# EAGLE design VCO-revb (EAGLE 9.6.2)
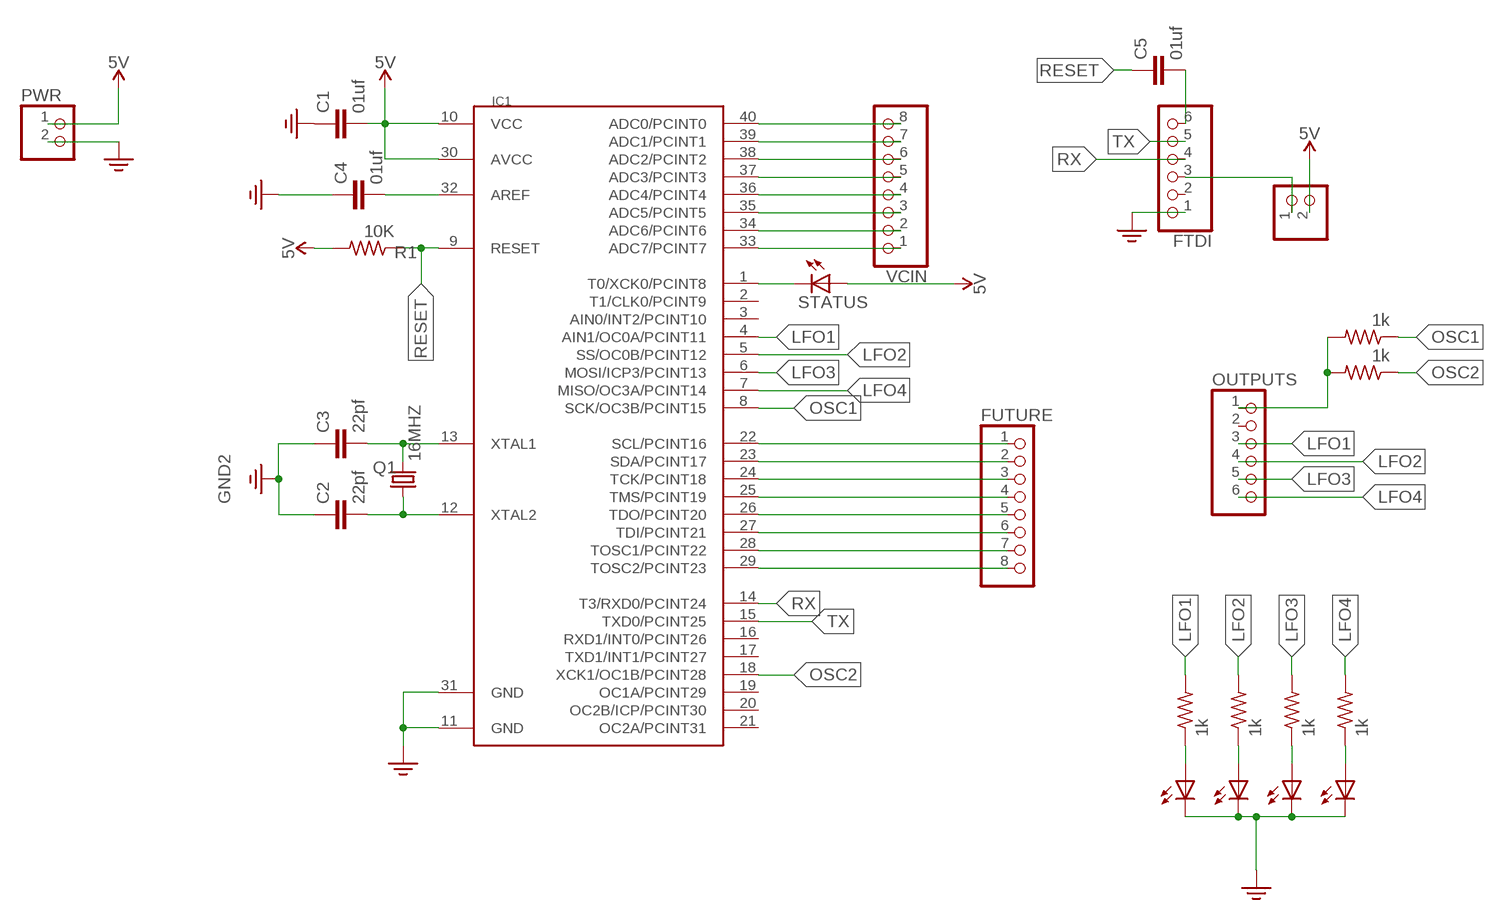
[diagram p0: schematic, sheet 1]

## Parts
C1  01uf  C-EU025-024X044  [C025-024X044]
C2  22pf  C-EU025-024X044  [C025-024X044]
C3  22pf  C-EU025-024X044  [C025-024X044]
C4  01uf  C-EU025-024X044  [C025-024X044]
C5  01uf  C-EU025-024X044  [C025-024X044]
FTDI  PINHD-1X6  [1X06]
FUTURE  PINHD-1X8BIG  [1X08-BIG]
IC1  MEGA1284P  [DIL40]
LFO1  LED5MM  [LED5MM]
LFO2  LED5MM  [LED5MM]
LFO3  LED5MM  [LED5MM]
LFO4  LED5MM  [LED5MM]
OUTPUTS  PINHD-1X6  [1X06]
PWR  PINHD-1X2  [1X02]
PWR1  PINHD-1X2  [1X02]
Q1  16MHZ  CRYSTALHC49S  [HC49/S]
R1  10K  R-US_0207/12  [0207/12]
R2  1k  R-US_0207/12  [0207/12]
R3  1k  R-US_0207/12  [0207/12]
R4  1k  R-US_0207/12  [0207/12]
R5  1k  R-US_0207/12  [0207/12]
R6  1k  R-US_0207/12  [0207/12]
R7  1k  R-US_0207/12  [0207/12]
STATUS  LED5MM  [LED5MM]
VCIN  PINHD-1X8  [1X08]

## Nets
3.3V: C1.1 C2.1 C3.1 C4.1 FTDI.1 IC1.11(GND) IC1.31(GND) LFO1.K(C) LFO2.K(C) LFO3.K(C) LFO4.K(C) PWR.2 ; supply symbol labelled GND2
LFO1: IC1.4(AIN1/OC0A/PCINT11) OUTPUTS.3 R4.2
LFO2: IC1.5(SS/OC0B/PCINT12) OUTPUTS.4 R3.2
LFO3: IC1.6(MOSI/ICP3/PCINT13) OUTPUTS.5 R2.2
LFO4: IC1.7(MISO/OC3A/PCINT14) OUTPUTS.6 R5.2
N$1: LFO1.A R4.1
N$2: IC1.40(ADC0/PCINT0) VCIN.8
N$3: IC1.39(ADC1/PCINT1) VCIN.7
N$4: IC1.38(ADC2/PCINT2) VCIN.6
N$5: IC1.37(ADC3/PCINT3) VCIN.5
N$6: IC1.36(ADC4/PCINT4) VCIN.4
N$7: IC1.35(ADC5/PCINT5) VCIN.3
N$8: IC1.34(ADC6/PCINT6) VCIN.2
N$9: IC1.33(ADC7/PCINT7) VCIN.1
N$10: C3.2 IC1.13(XTAL1) Q1.2
N$11: C2.2 IC1.12(XTAL2) Q1.1
N$12: LFO2.A R3.1
N$13: C4.2 IC1.32(AREF)
N$14: C5.2 FTDI.6
N$15: LFO3.A R2.1
N$16: LFO4.A R5.1
N$17: OUTPUTS.1 R6.2 R7.2
N$18: FUTURE.1 IC1.22(SCL/PCINT16)
N$19: FUTURE.2 IC1.23(SDA/PCINT17)
N$20: FUTURE.3 IC1.24(TCK/PCINT18)
N$21: FUTURE.4 IC1.25(TMS/PCINT19)
N$22: FUTURE.5 IC1.26(TDO/PCINT20)
N$23: FTDI.3 PWR1.1
N$24: IC1.1(T0/XCK0/PCINT8) STATUS.K(C)
N$25: FUTURE.6 IC1.27(TDI/PCINT21)
N$26: FUTURE.7 IC1.28(TOSC1/PCINT22)
N$27: FUTURE.8 IC1.29(TOSC2/PCINT23)
OSC1: IC1.8(SCK/OC3B/PCINT15) R6.1
OSC2: IC1.18(XCK1/OC1B/PCINT28) R7.1
RESET: C5.1 IC1.9(RESET) R1.1
RX: FTDI.4 IC1.14(T3/RXD0/PCINT24)
TX: FTDI.5 IC1.15(TXD0/PCINT25)
VDD: C1.2 IC1.10(VCC) IC1.30(AVCC) PWR1.2 PWR.1 R1.2 STATUS.A ; supply symbol labelled 5V
Unconnected: FTDI.2 IC1.2(T1/CLK0/PCINT9) IC1.3(AIN0/INT2/PCINT10) IC1.16(RXD1/INT0/PCINT26) IC1.17(TXD1/INT1/PCINT27) IC1.19(OC1A/PCINT29) IC1.20(OC2B/ICP/PCINT30) IC1.21(OC2A/PCINT31) OUTPUTS.2

## Library data of the parts
C1-C5 = rcl:C-EU: CAPACITOR, European symbol; SPICEPREFIX: C
FTDI = pinhead:PINHD-1X6: PIN HEADER
FUTURE = adafruit:PINHD-1X8: PIN HEADER
IC1 = 1284p:MEGA1284P: Atmel ATmega1284P 8-bit AVR Microcontroller
LFO1-LFO4 STATUS = adafruit:LED: LED OSRAM: - CHIPLED LG R971, LG N971, LY N971, LG Q971, LY Q971, LO R971, LY R971 LH N974, LH R974 LS Q976, LO Q976, LY Q976 LO Q996 - Hyper CHIPLED LW Q18S LB Q993, LB Q99A, LB R99A - SideLED LS A670, LO A670, LY A670, LG A670, LP A670 LB A673, LV A673, LT A673, LW A673 LH A674 LY A675 LS A676, LA A676, LO A676, LY A676, LW A676 LS A679, LY A679, LG A679 - Hyper Micro SIDELED® LS Y876, LA Y876, LO Y876, LY Y876 LT Y87S - SmartLED LW L88C, LW L88S LB L89C, LB L89S, LG L890 LS L89K, LO L89K, LY L89K LS L896, LA L896, LO L896, LY L896 - TOPLED LS T670, LO T670, LY T670, LG T670, LP T670 LSG T670, LSP T670, LSY T670, LOP T670, LYG T670 LG T671, LOG T671, LSG T671 LB T673, LV T673, LT T673, LW T673 LH T674 LS T676, LA T676, LO T676, LY T676, LB T676, LH T676, LSB T676, LW T676 LB T67C, LV T67C, LT T67C, LS T67K, LO T67K, LY T67K, LW E67C LS E67B, LA E67B, LO E67B, LY E67B, LB E67C, LV E67C, LT E67C LW T67C LS T679, LY T679, LG T679 LS T770, LO T770, LY T770, LG T770, LP T770 LB T773, LV T773, LT T773, LW T773 LH T774 LS E675, LA E675, LY E675, LS T675 LS T776, LA T776, LO T776, LY T776, LB T776 LHGB T686 LT T68C, LB T68C - Hyper Mini TOPLED® LB M676 - Mini TOPLED Santana® LG M470 LS M47K, LO M47K, LY M47K Source: http://www.osram.convergy.de/
OUTPUTS = adafruit:PINHD-1X6: PIN HEADER
PWR PWR1 = pinhead:PINHD-1X2: PIN HEADER
Q1 = adafruit:CRYSTAL: CRYSTAL; OC_FARNELL: 1667008; OC_NEWARK: unknown
R1-R7 = adafruit:R-US_: RESISTOR, American symbol
VCIN = pinhead:PINHD-1X8: PIN HEADER

## Net classes
0 default: clearance 0.205 mm

## Board
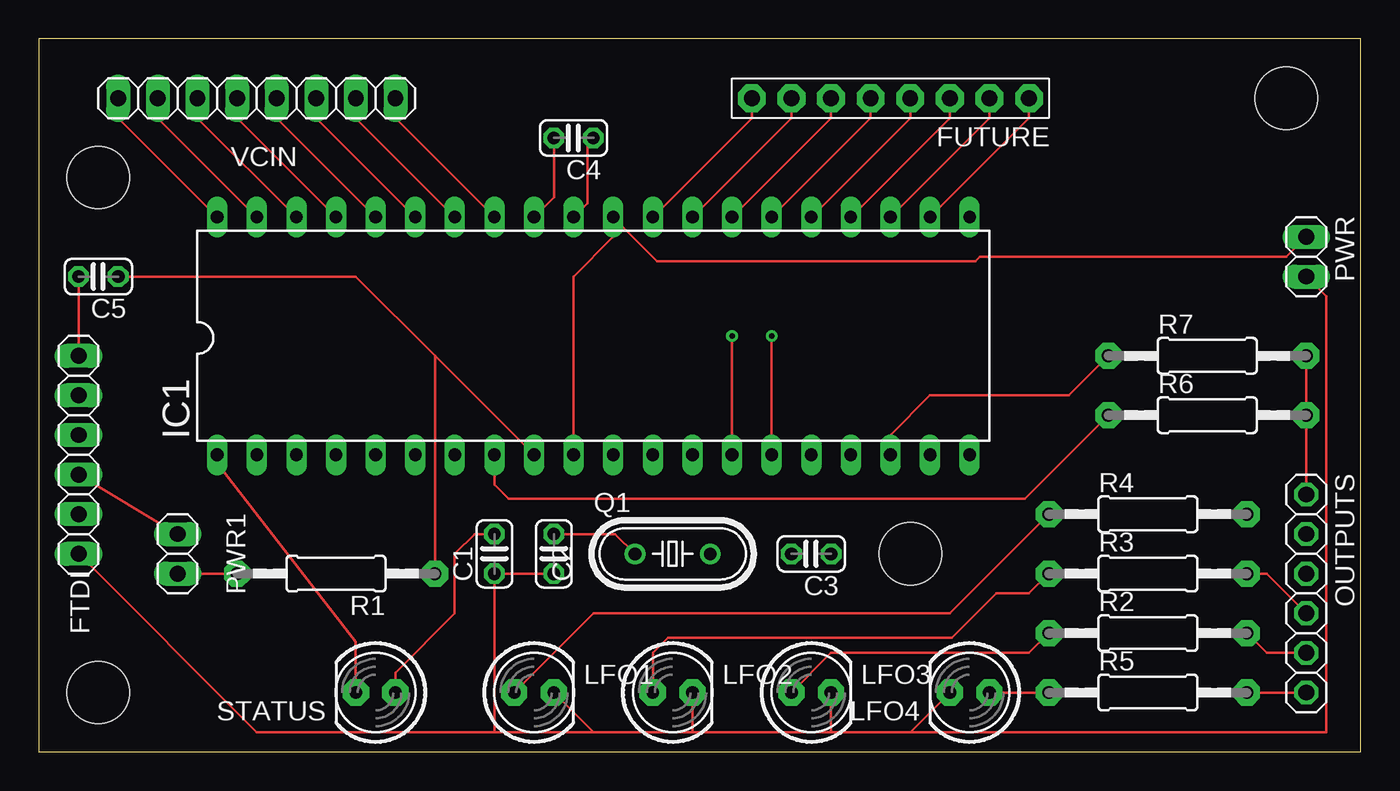
[diagram p1: board, top side]
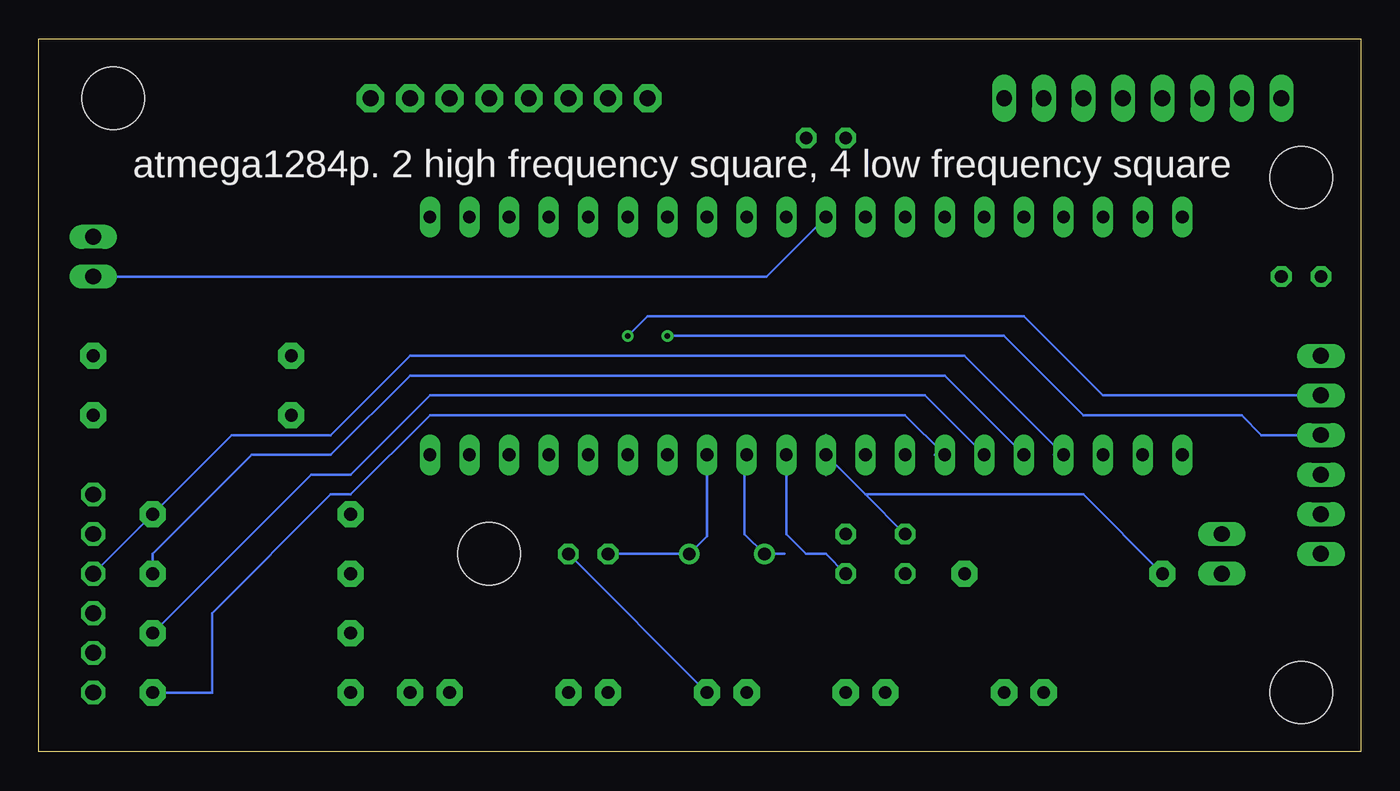
[diagram p2: board, bottom side, seen from below]

Size 84.76 x 45.71 mm. Coordinates in mm from the lower left corner, seen from the top.
Outline: 0,0 84.76,0 84.76,45.71 0,45.71 0,0
Copper layers (1*16): Top 0.035mm / dielectric 1.5mm / Bottom 0.035mm
Design rules "default": minimum track width 6mil, minimum drill 0.35mm, track to track 6mil, track to pad 6mil, pad to pad 6mil, via to via 6mil, smd to smd 6mil, copper to edge 40mil, drill to drill 6mil, minimum pad ring 10mil, minimum via ring 8mil, stop-mask expansion 4mil, vias tented up to drill 0mil, thermal gap 10mil
Holes 4 mm at 80.01,41.91 3.81,3.81 3.81,36.83 55.88,12.7

### Footprints (pad centres in the part's own frame; a part is rotated, then mirrored left to right if it is on the bottom)
C025-024X044 = drill 0.813 octagon: 1 -1.27,0; 2 1.27,0
1X06 = drill 1.016 long: 1 -6.35,0; 2 -3.81,0; 3 -1.27,0; 4 1.27,0; 5 3.81,0; 6 6.35,0
1X08-BIG = drill 1.016 pad 1.778 octagon: 1 -8.89,0; 2 -6.35,0; 3 -3.81,0; 4 -1.27,0; 5 1.27,0; 6 3.81,0; 7 6.35,0; 8 8.89,0
DIL40 = drill 0.813 long: 1 -24.13,-7.62; 2 -21.59,-7.62; 3 -19.05,-7.62; 4 -16.51,-7.62; 5 -13.97,-7.62; 6 -11.43,-7.62; 7 -8.89,-7.62; 8 -6.35,-7.62; 9 -3.81,-7.62; 10 -1.27,-7.62; 11 1.27,-7.62; 12 3.81,-7.62; 13 6.35,-7.62; 14 8.89,-7.62; 15 11.43,-7.62; 16 13.97,-7.62; 17 16.51,-7.62; 18 19.05,-7.62; 19 21.59,-7.62; 20 24.13,-7.62; 21 24.13,7.62; 22 21.59,7.62; 23 19.05,7.62; 24 16.51,7.62; 25 13.97,7.62; 26 11.43,7.62; 27 8.89,7.62; 28 6.35,7.62; 29 3.81,7.62; 30 1.27,7.62; 31 -1.27,7.62; 32 -3.81,7.62; 33 -6.35,7.62; 34 -8.89,7.62; 35 -11.43,7.62; 36 -13.97,7.62; 37 -16.51,7.62; 38 -19.05,7.62; 39 -21.59,7.62; 40 -24.13,7.62
LED5MM = drill 0.813 pad 1.676 octagon: A -1.27,0; K 1.27,0
1X06' = drill 1.016 octagon: 1 -6.35,0; 2 -3.81,0; 3 -1.27,0; 4 1.27,0; 5 3.81,0; 6 6.35,0
1X02 = drill 1.016 long: 1 -1.27,0; 2 1.27,0
HC49/S = drill 0.813: 1 -2.413,0; 2 2.413,0
0207/12 = drill 0.813 pad 1.676 octagon: 1 -6.35,0; 2 6.35,0
1X08 = drill 1.016 long: 1 -8.89,0; 2 -6.35,0; 3 -3.81,0; 4 -1.27,0; 5 1.27,0; 6 3.81,0; 7 6.35,0; 8 8.89,0

### Placement (x,y rotation side)
C1  29.21,12.7 90 top
C2  33.02,12.7 90 top
C3  49.53,12.7 180 top
C4  34.29,39.37 180 top
C5  3.81,30.48 180 top
FTDI  2.54,19.05 90 top
FUTURE  54.61,41.91 180 top
IC1  35.56,26.67 0 top
LFO1  31.75,3.81 0 top
LFO2  40.64,3.81 0 top
LFO3  49.53,3.81 0 top
LFO4  59.69,3.81 180 top
OUTPUTS  [1X06']  81.28,10.16 270 top
PWR  81.28,31.75 270 top
PWR1  8.89,12.7 270 top
Q1  40.64,12.7 0 top
R1  19.05,11.43 180 top
R2  71.12,7.62 0 top
R3  71.12,11.43 0 top
R4  71.12,15.24 0 top
R5  71.12,3.81 0 top
R6  74.93,21.59 0 top
R7  74.93,25.4 0 top
STATUS  21.59,3.81 180 top
VCIN  13.97,41.91 180 top

### Tracks (layer width: path | path; a pad name or v marks a point on that pad's centre or on a via)
3.3V
  Top 0.152: C4.1 35.18,38.99 35.18,35.18 IC1.31 | LFO1.K 35.56,1.27 | 41.91,1.27 35.56,1.27 | 41.91,1.27 50.8,1.27 | 50.8,1.27 55.88,1.27 | LFO3.K 50.8,1.27 | LFO2.K 41.91,1.27 | 55.88,1.27 LFO4.K | FTDI.1 13.97,1.27 22.86,1.27 29.21,1.27 | 35.56,1.27 29.21,1.27 | PWR.2 82.55,29.21 82.55,1.27 55.88,1.27 | C2.1 C1.1 29.21,1.27
  Bottom 0.152: C3.1 LFO2.K | 36.83,17.14 IC1.11 36.83,13.97 35.56,12.7 34.29,12.7 C2.1 | PWR.2 38.1,30.48 IC1.31
LFO1
  Bottom 0.152: 19.67,19.05 IC1.4 25.4,25.4 60.96,25.4 66.04,20.32 72.39,20.32 R4.2 OUTPUTS.3
LFO2
  Top 0.152: R3.2 78.74,11.43 OUTPUTS.4
  Bottom 0.152: IC1.5 26.67,24.13 60.96,24.13 66.04,19.05 71.12,19.05 77.47,12.7 R3.2
LFO3
  Top 0.152: R2.2 78.74,6.35 OUTPUTS.5
  Bottom 0.152: R2.2 67.31,17.78 64.77,17.78 59.69,22.86 27.94,22.86 IC1.6
LFO4
  Top 0.152: R5.2 OUTPUTS.6
  Bottom 0.152: 27.29,19.05 IC1.7 29.21,21.59 59.69,21.59 64.77,16.51 66.04,16.51 73.66,8.89 73.66,3.81 R5.2
N$1
  Top 0.152: R4.1 58.42,8.89 35.56,8.89 LFO1.A
N$2
  Top 0.152: VCIN.8 5.08,40.64 IC1.40
N$3
  Top 0.152: VCIN.7 7.62,40.64 IC1.39
N$4
  Top 0.152: VCIN.6 10.16,40.64 IC1.38
N$5
  Top 0.152: VCIN.5 12.7,40.64 IC1.37
N$6
  Top 0.152: VCIN.4 15.24,40.64 IC1.36
N$7
  Top 0.152: VCIN.3 17.78,40.64 IC1.35
N$8
  Top 0.152: VCIN.2 20.32,40.64 IC1.34
N$9
  Top 0.152: VCIN.1 22.86,40.64 IC1.33
N$10
  Bottom 0.152: IC1.13 41.91,13.84 Q1.2 C3.2
N$11
  Top 0.152: C2.2 36.96,13.97 Q1.1
  Bottom 0.152: IC1.12 39.5,18.92 39.5,13.97 Q1.1 36.96,12.7
N$12
  Top 0.152: LFO2.A 39.37,6.35 40.34,7.32 58.55,7.32 61.39,10.16 63.5,10.16 R3.1
N$13
  Top 0.152: IC1.32 33.02,35.56 C4.2
N$14
  Top 0.152: C5.2 FTDI.6
N$15
  Top 0.152: LFO3.A 50.8,6.35 63.5,6.35 R2.1
N$16
  Top 0.152: LFO4.A R5.1
N$17
  Top 0.152: R6.2 R7.2 OUTPUTS.1
N$18
  Top 0.152: FUTURE.1 63.5,40.64 IC1.22
N$19
  Top 0.152: FUTURE.2 60.96,40.64 IC1.23
N$20
  Top 0.152: FUTURE.3 58.42,40.64 IC1.24
N$21
  Top 0.152: FUTURE.4 55.88,40.64 IC1.25
N$22
  Top 0.152: FUTURE.5 53.34,40.64 IC1.26
N$23
  Top 0.152: PWR1.1 FTDI.3
N$24
  Top 0.152: STATUS.K 20.32,7.08 11.43,18.51 IC1.1
N$25
  Top 0.152: FUTURE.6 50.8,40.64 IC1.27
N$26
  Top 0.152: FUTURE.7 48.26,40.64 IC1.28
N$27
  Top 0.152: FUTURE.8 45.72,40.64 IC1.29
OSC1
  Top 0.152: IC1.8 29.21,17.13 30.11,16.23 63.22,16.23 R6.1
OSC2
  Top 0.152: R7.1 66.04,22.86 57.15,22.86 54.61,20.32 IC1.18
RESET
  Top 0.152: C5.1 20.32,30.48 25.4,25.4 | 25.4,25.4 IC1.9 | R1.1 25.4,25.4
RX  (via drill 0.35)
  Top 0.152: v44.45,26.67 IC1.14
  Bottom 0.152: FTDI.4 6.35,20.32 7.62,21.59 17.78,21.59 22.86,26.67 v44.45,26.67
TX  (via drill 0.35)
  Top 0.152: v46.99,26.67 IC1.15
  Bottom 0.152: FTDI.5 16.51,22.86 21.59,27.94 45.72,27.94 v46.99,26.67
VDD
  Top 0.152: PWR.1 80.01,31.75 60.34,31.75 60.06,31.47 39.65,31.47 IC1.30 36.83,33.02 34.29,30.48 IC1.10 | PWR1.2 R1.2 | STATUS.A 22.86,5.08 26.67,8.89 26.67,12.7 27.94,13.97 C1.2
  Bottom 0.152: 34.29,17.78 IC1.10 | R1.2 17.78,16.51 31.75,16.51 | 31.75,16.51 IC1.10 | IC1.10 34.29,20.32 | C1.2 31.75,16.51

### Text on the board
bPlace: atmega1284p. 2 high frequency square, 4 low frequency square